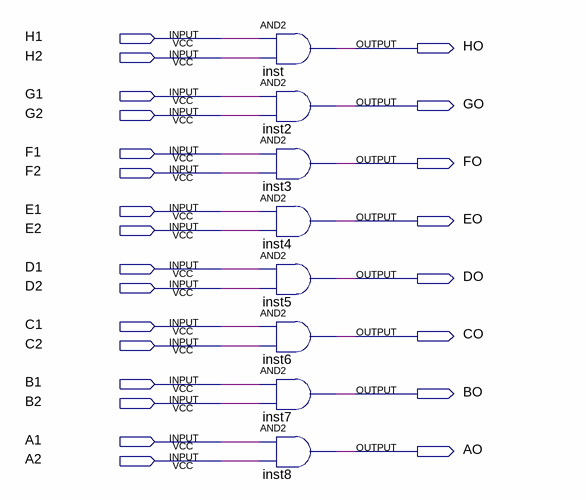
[diagram p0: schematic sheet]
// Quartus schematic AND.bdf as structural Verilog: 8 symbols, 24 pins
module AND (
  input  H1,
  input  H2,
  input  G1,
  input  G2,
  input  F1,
  input  F2,
  input  E1,
  input  E2,
  input  D1,
  input  D2,
  input  C1,
  input  C2,
  input  B1,
  input  B2,
  input  A1,
  input  A2,
  output HO,
  output GO,
  output FO,
  output EO,
  output DO,
  output CO,
  output BO,
  output AO
);

  and inst (HO, H1, H2);
  and inst2 (GO, G1, G2);
  and inst3 (FO, F1, F2);
  and inst4 (EO, E1, E2);
  and inst5 (DO, D1, D2);
  and inst6 (CO, C1, C2);
  and inst7 (BO, B1, B2);
  and inst8 (AO, A1, A2);
endmodule
